# Altium project FD-JUL-CB1.PrjPcb
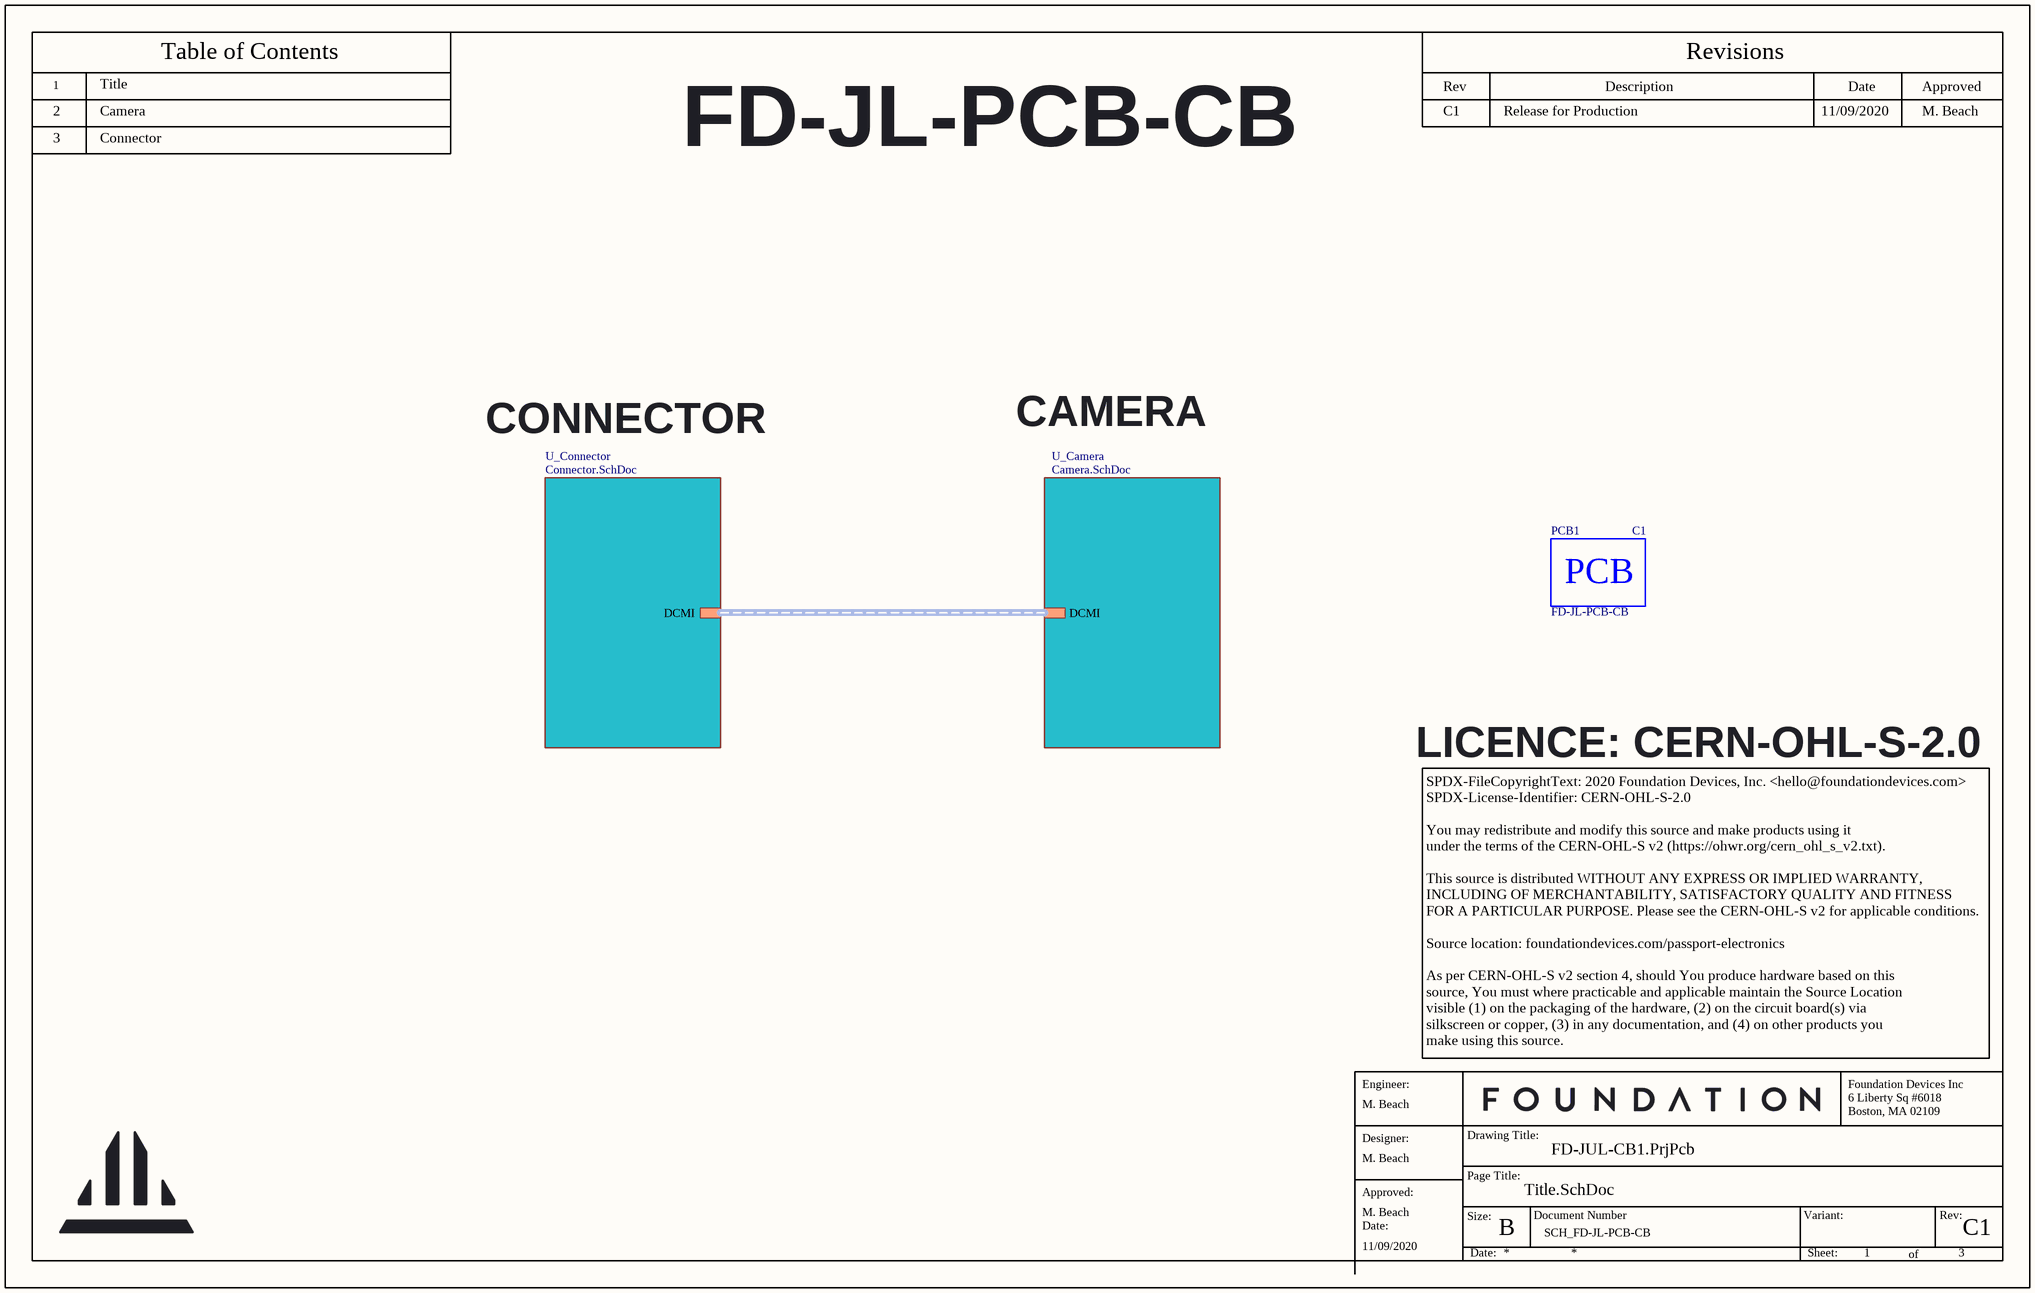
[diagram p0: Title.SchDoc]
SCH_REV: C1; PCB_REV: C1; PCB_PART_NUMBER: FD-JL-PCB-CB; PCB_ENGINEER_APP_DATE: 11/09/2020; PCB_ENGINEER: M. Beach; PCB_DWG_NO: PCB-DWG_FD-JL-PCB-CB; PCB_DESIGNER_APP_DATE: 11/09/2020; PCB_DESIGNER: M. Beach; PCB_CHECKER_APP_DATE: 11/09/2020; PCB_CHECKER: M. Beach; PCB_ASSEMBLY_NO: PCB-ASSY_FD-JL-PCB-CB; PCB_ANG_TOL: +/-1/2; PCB_3_DEC_TOL: +/-.010; PCB_2_DEC_TOL: +/-.01; NotFitted: NF; DOC_NO_SCH_DWG: SCH_FD-JL-PCB-CB; DOC_NO_FAB_DWG: FAB_FD-JL-PCB-CB; DOC_NO_BOM: BOM_FD-JL-PCB-CB; DOC_NO_ASSY_DWG: ASSY_FD-JL-PCB-CB
3 sheets, 21 parts. Net scope: hierarchical (ports join the sheet entries above them; power ports are global).
Board file: FD-JUL-CB1_PCB.PcbDoc
Sheets:
  Title.SchDoc
    U_Connector = Connector.SchDoc
    U_Camera = Camera.SchDoc

## Sheet Title.SchDoc
size B; DocumentNumber: 1; SheetNumber: 1; SheetTotal: 3; ENG_APP_DATE: --/--/--; DSN_APP_DATE: --/--/--; CHK_APP_DATE: --/--/--

### Parts
PCB1  FD-JL-PCB-CB  Rev: C1  (mechanical)

### Sub-sheets
U_Camera = Camera.SchDoc: DCMI (harness DCMI)
U_Connector = Connector.SchDoc: DCMI (harness DCMI)

### Buses and harness runs
harness sheet U_Camera/DCMI = sheet U_Connector/DCMI

### Notes on the sheet
- Title
- 2
- 3
- Camera
- Connector
- FD-JL-PCB-CB
- C1
- Release for Production
- 11/09/2020
- M. Beach
- CAMERA
- CONNECTOR
- LICENCE: CERN-OHL-S-2.0
- SPDX-FileCopyrightText: 2020 Foundation Devices, Inc. <hello@foundationdevices.com>
  SPDX-License-Identifier: CERN-OHL-S-2.0
  You may redistribute and modify this source and make products using it
  under the terms of the CERN-OHL-S v2 (https://ohwr.org/cern_ohl_s_v2.txt).
  This source is distributed WITHOUT ANY EXPRESS OR IMPLIED WARRANTY,
  INCLUDING OF MERCHANTABILITY, SATISFACTORY QUALITY AND FITNESS
  FOR A PARTICULAR PURPOSE. Please see the CERN-OHL-S v2 for applicable conditions.
  Source location: foundationdevices.com/passport-electronics
  As per CERN-OHL-S v2 section 4, should You produce hardware based on this
  source, You must where practicable and applicable maintain the Source Location
  visible (1) on the packaging of the hardware, (2) on the circuit board(s) via
  silkscreen or copper, (3) in any documentation, and (4) on other products you
  make using this source.
- 1
- Table of Contents
- Rev
- Description
- Revisions
- Date
- Approved
- Engineer:
- Foundation Devices Inc
- 6 Liberty Sq #6018
- Designer:
- Drawing Title:
- Page Title:
- Boston, MA 02109
- Approved:
- Date:
- Size:
- B
- Document Number
- Variant:
- Rev:
- Sheet:
- of

### Library data of the parts
PCB1 = CMP-MISC-00003-3: PCB - Juliet - Camera Board

## Sheet Connector.SchDoc
size B; DocumentNumber: 3; SheetNumber: 3; SheetTotal: 3; ENG_APP_DATE: --/--/--; DSN_APP_DATE: --/--/--; CHK_APP_DATE: --/--/--
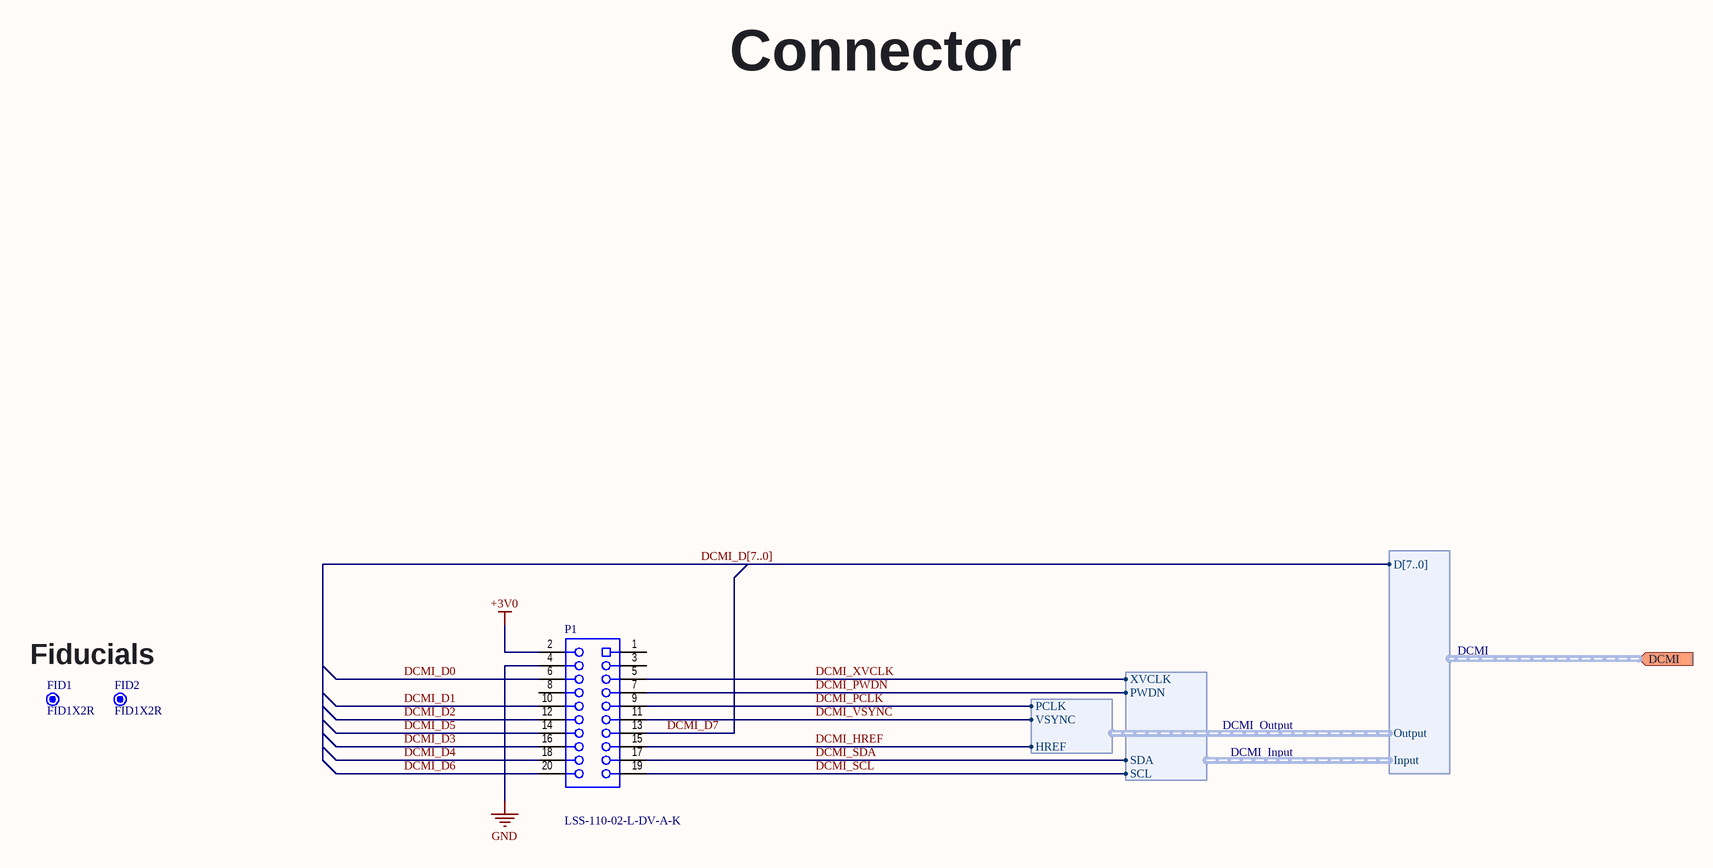
[diagram p1: Connector.SchDoc]

### Parts
FID1  FID1X2R  [FID1X2R]  (no BOM)
FID2  FID1X2R  [FID1X2R]  (no BOM)
P1  LSS-110-02-L-DV-A-K  [SMTC - LSS-110-02-L-DV-A_V]

### Ports
DCMI (in, harness DCMI)

### Harnesses
DCMI: Input, Output, D[7..0]
DCMI_Input: PWDN, SCL, SDA, XVCLK
DCMI_Output: HREF, PCLK, VSYNC

### Nets
+3V0: P1.2
GND: P1.4
DCMI_D0: P1.6
DCMI_D1: P1.10
DCMI_D2: P1.12
DCMI_D3: P1.16
DCMI_D4: P1.18
DCMI_D5: P1.14
DCMI_D6: P1.20
DCMI_D7: P1.13
DCMI_HREF: P1.15 ; harness DCMI_Output.HREF
DCMI_PCLK: P1.9 ; harness DCMI_Output.PCLK
DCMI_PWDN: P1.7 ; harness DCMI_Input.PWDN
DCMI_SCL: P1.19 ; harness DCMI_Input.SCL
DCMI_SDA: P1.17 ; harness DCMI_Input.SDA
DCMI_VSYNC: P1.11 ; harness DCMI_Output.VSYNC
DCMI_XVCLK: P1.5 ; harness DCMI_Input.XVCLK

Not connected (* = marked no-connect by the designer): P1 1 3 8

### Buses and harness runs
bus DCMI_D[7..0]

### Notes on the sheet
- Connector
- Fiducials
- Drawing Title:
- Page Title:
- Size:
- B
- Document Number
- Variant:
- Rev:
- Date:
- Sheet:
- of

### Library data of the parts
FID1 FID2 = CMP-MECH-00000-3: Fiducial - Round 1x2mm; Pins: 0
P1 = CMP-CON-0021-3: 20 Position Connector Self Mating, Non-Gendered Surface Mount Gold; Number of Contacts: 20; Pitch: 0.635mm; Termination: Solder; Radiation Hardening: No; Number of Rows: 2; Packaging: Bulk; Contact Plating: Gold

## Sheet Camera.SchDoc
size B; DocumentNumber: 2; SheetNumber: 2; SheetTotal: 3; ENG_APP_DATE: --/--/--; DSN_APP_DATE: --/--/--; CHK_APP_DATE: --/--/--
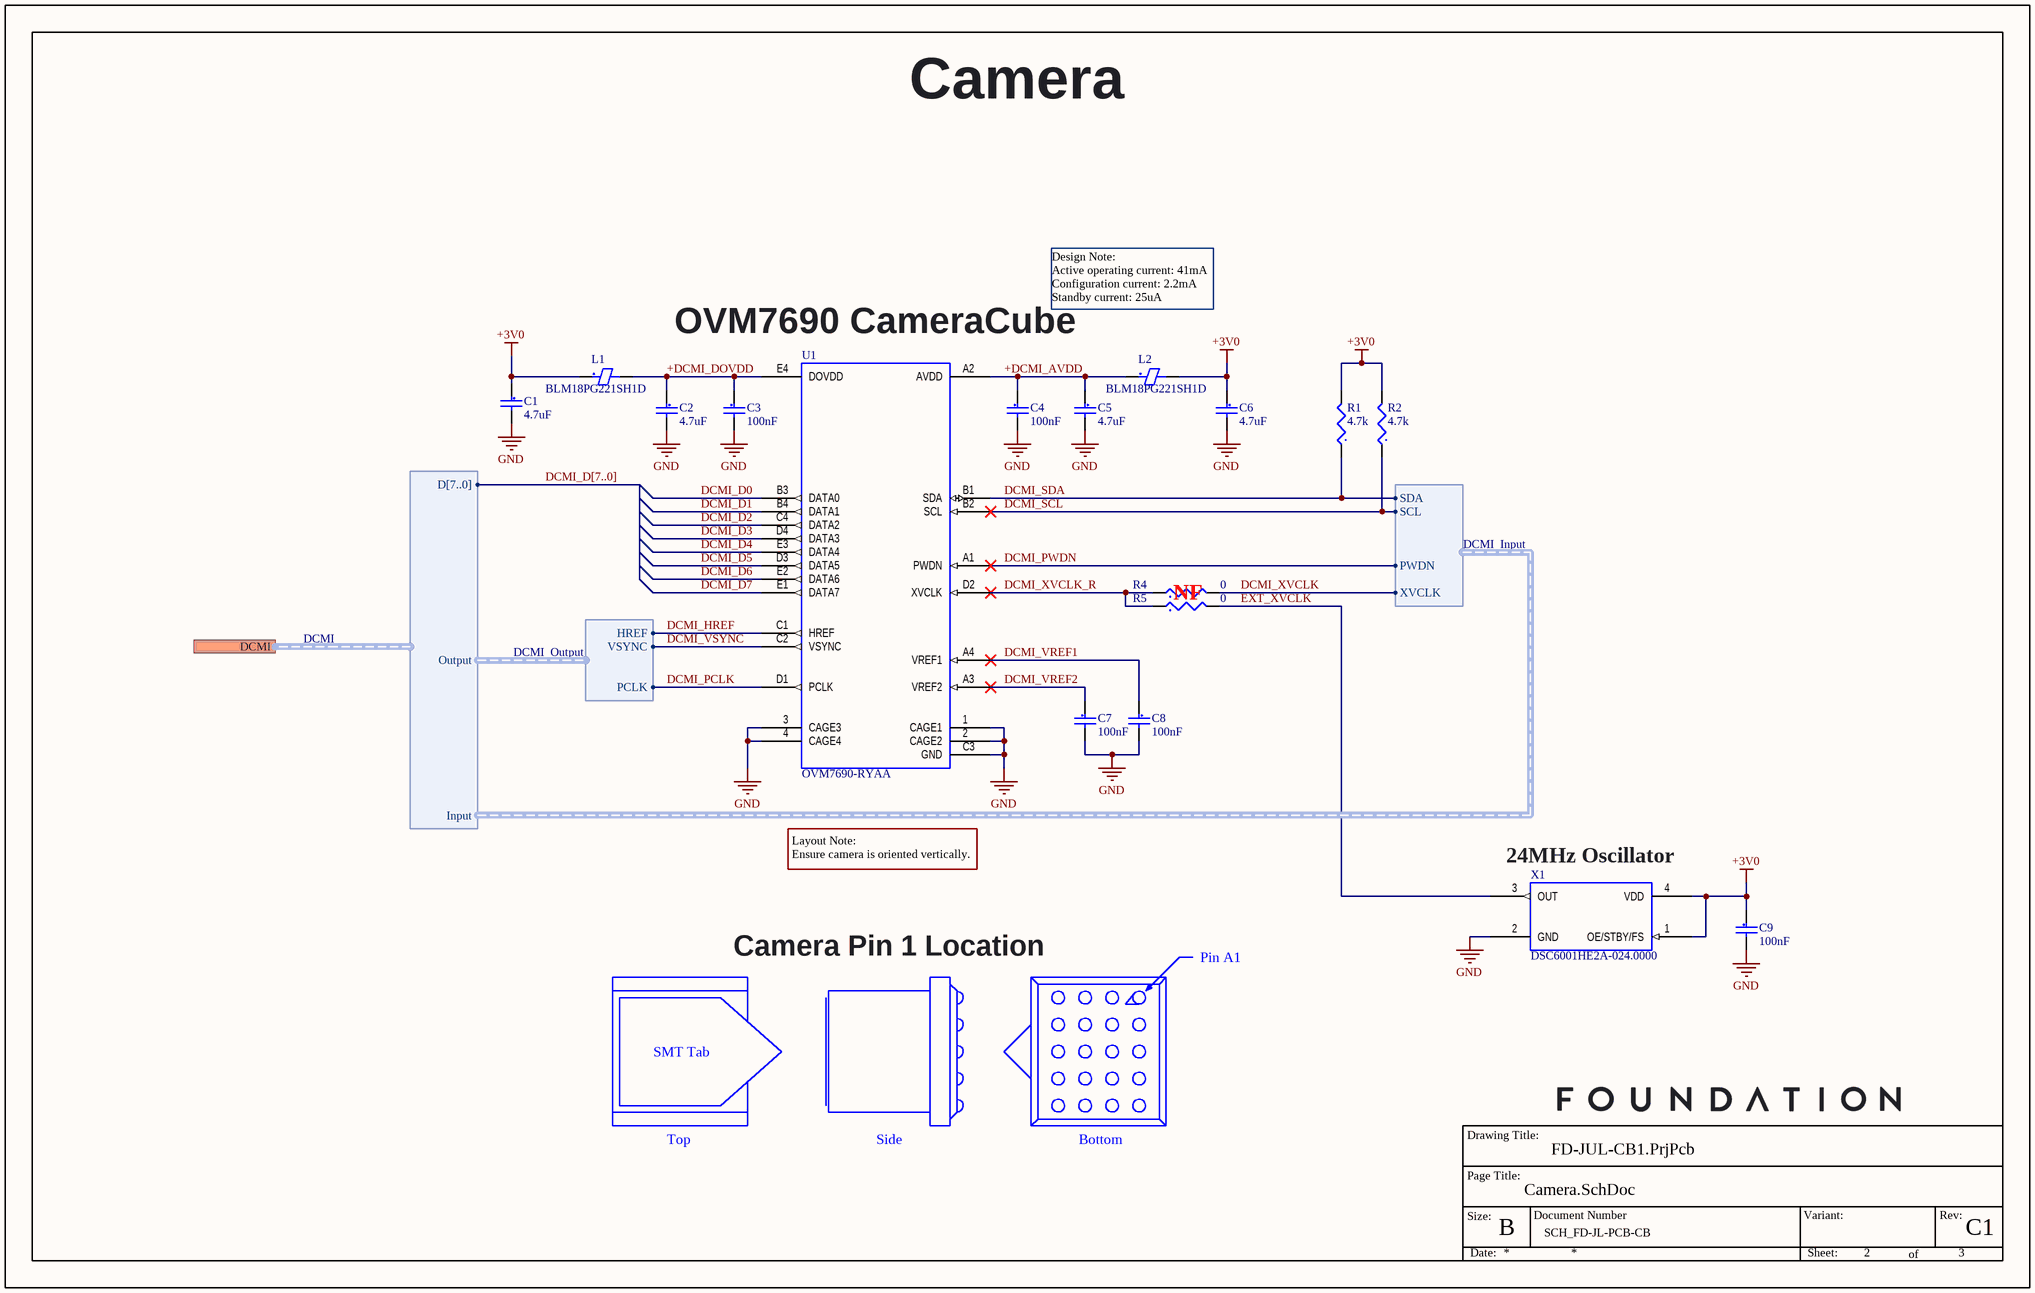
[diagram p2: Camera.SchDoc]

### Parts
C1  Capacitance: 4.7uF  [CAPC0603(1608)90_L]  (hidden comment: CAP CER 4.7uF 16V 10% X5R 0603)
C2  Capacitance: 4.7uF  [CAPC0603(1608)90_L]  (hidden comment: CAP CER 4.7uF 16V 10% X5R 0603)
C3  Capacitance: 100nF  [CAPC0402(1005)55_L]  (hidden comment: CAP CER 0.1uF 16V 10% X7R 0402)
C4  Capacitance: 100nF  [CAPC0402(1005)55_L]  (hidden comment: CAP CER 0.1uF 16V 10% X7R 0402)
C5  Capacitance: 4.7uF  [CAPC0603(1608)90_L]  (hidden comment: CAP CER 4.7uF 16V 10% X5R 0603)
C6  Capacitance: 4.7uF  [CAPC0603(1608)90_L]  (hidden comment: CAP CER 4.7uF 16V 10% X5R 0603)
C7  Capacitance: 100nF  [CAPC0402(1005)55_L]  (hidden comment: CAP CER 0.1uF 16V 10% X7R 0402)
C8  Capacitance: 100nF  [CAPC0402(1005)55_L]  (hidden comment: CAP CER 0.1uF 16V 10% X7R 0402)
C9  Capacitance: 100nF  [CAPC0402(1005)55_L]  (hidden comment: CAP CER 0.1uF 16V 10% X7R 0402)
L1  BLM18PG221SH1D  [FBC0603(1608)90_L]
L2  BLM18PG221SH1D  [FBC0603(1608)90_L]
R1  Resistance: 4.7k  [RESC0402(1005)_L]  (hidden comment: RES 4.7K 1/16W 1% 0402)
R2  Resistance: 4.7k  [RESC0402(1005)_L]  (hidden comment: RES 4.7K 1/16W 1% 0402)
R4  Resistance: 0  [RESC0402(1005)_L]  (hidden comment: RES 0 OHM JUMPER 1/16W 0402)
R5  Resistance: 0  [RESC0402(1005)_L]  (hidden comment: RES 0 OHM JUMPER 1/16W 0402)
U1  OVM7690-RYAA  [OMNI - CCBGA-CG-20]
X1  DSC6001HE2A-024.0000  [MCHP - VFLGA-1612-4_L]

### Ports
DCMI (harness DCMI)

### Harnesses
DCMI_Input: SDA, SCL, PWDN, XVCLK
DCMI_Output: HREF, VSYNC, PCLK
DCMI: Input, Output, D[7..0]

### Nets
+3V0: C1.1 C6.1 C9.1 L1.1 L2.2 R1.2 R2.2 X1.1(OE/STBY/FS) X1.4(VDD)
GND: C1.2 C2.2 C3.2 C4.2 C5.2 C6.2 C7.2 C8.2 C9.2 U1.1(CAGE1) U1.2(CAGE2) U1.3(CAGE3) U1.4(CAGE4) U1.C3(GND) X1.2(GND)
+DCMI_AVDD: C4.1 C5.1 L2.1 U1.A2(AVDD)
+DCMI_DOVDD: C2.1 C3.1 L1.2 U1.E4(DOVDD)
DCMI_D0: U1.B3(DATA0)
DCMI_D1: U1.B4(DATA1)
DCMI_D2: U1.C4(DATA2)
DCMI_D3: U1.D4(DATA3)
DCMI_D4: U1.E3(DATA4)
DCMI_D5: U1.D3(DATA5)
DCMI_D6: U1.E2(DATA6)
DCMI_D7: U1.E1(DATA7)
DCMI_HREF: U1.C1(HREF) ; harness DCMI_Output.HREF
DCMI_PCLK: U1.D1(PCLK) ; harness DCMI_Output.PCLK
DCMI_PWDN: U1.A1(PWDN) ; harness DCMI_Input.PWDN
DCMI_SCL: R2.1 U1.B2(SCL) ; harness DCMI_Input.SCL
DCMI_SDA: R1.1 U1.B1(SDA) ; harness DCMI_Input.SDA
DCMI_VREF1: C8.1 U1.A4(VREF1)
DCMI_VREF2: C7.1 U1.A3(VREF2)
DCMI_VSYNC: U1.C2(VSYNC) ; harness DCMI_Output.VSYNC
DCMI_XVCLK: R4.2 ; harness DCMI_Input.XVCLK
DCMI_XVCLK_R: R4.1 R5.1 U1.D2(XVCLK)
EXT_XVCLK: R5.2 X1.3(OUT)

### Buses and harness runs
bus DCMI_D[7..0]

### Notes on the sheet
- Camera
- (near U1) OVM7690 CameraCube
- Design Note:
  Active operating current: 41mA
  Configuration current: 2.2mA
  Standby current: 25uA
- Layout Note:
  Ensure camera is oriented vertically.
- (near X1) 24MHz Oscillator
- Camera Pin 1 Location
- Pin A1
- SMT Tab
- Top
- Side
- Bottom
- Drawing Title:
- Page Title:
- Size:
- B
- Document Number
- Variant:
- Rev:
- Date:
- Sheet:
- of

### Library data of the parts
C1 C2 C5 C6 = CMP-CAP-00003-1: 4.7µF ±10% 16V Ceramic Capacitor X5R 0603 (1608 Metric); Length: 1.6mm; Termination: SMD/SMT; Max Operating Temperature: 85°C; Case Code (Imperial): 0603; Height: 0.8mm; Voltage Rating: 16V; Composition: Ceramic; Dielectric: X5R; Voltage Rating (DC): 16V; REACH SVHC: No SVHC; Case Code (Metric): 1608; Tolerance: 10%; Case/Package: 0603; Min Operating Temperature: -55°C; Width: 0.8mm; Mount: Surface Mount; Packaging: Tape and Reel; Package Quantity: 1; Thickness: 0.035inch; Number of Pins: 2
C3 C4 C7-C9 = CMP-CAP-00002-2: 0.1µF ±10% 16V Ceramic Capacitor X7R 0402 (1005 Metric); Insulation Resistance: 10GR; Material: Ceramic; Tolerance: 10%; REACH SVHC: No SVHC; Radiation Hardening: No; Case Code (Metric): 1005; Height: 0.5mm; Depth: 0.5mm; Min Operating Temperature: -55°C; Max Operating Temperature: 125°C; Lead Free: Lead Free; Thickness: 0.022inch; Length: 1mm; Voltage Rating (DC): 16V; Dielectric Material: Ceramic; Packaging: Tape and Reel; Case/Package: 0402; Width: 0.5mm; Termination: SMD/SMT; Voltage Rating: 16V; Mount: Surface Mount; Case Code (Imperial): 0402; Package Quantity: 1; Dielectric: X7R; Number of Pins: 2; Voltage: 16V
L1 L2 = CMP-FLT-0001-1: FERRITE BEAD 220 OHM 0603 1LN; Impedance: 220R; Number of Circuits: 1; Tolerance: 25%; Max DC Current: 1.4A; Test Frequency: 100MHz; DC Resistance (DCR): 100mR; Packaging: Tape and Reel; Length: 0.063inch; Case Code (Metric): 1608; Termination: SMD/SMT; Height: 0.037inch; Ratings: AEC-Q200; Max Operating Temperature: 125°C; Depth: 0.95mm; Lead Free: Lead Free; Current Rating: 1.4A; Mount: Surface Mount; ComponentLink1Description: Datasheet; Case/Package: 0603; Number of Lines: 1; Max Current Rating: 1.4A; Case Code (Imperial): 0603; Min Operating Temperature: -55°C; Width: 0.8mm; REACH SVHC: No SVHC; Core Material: Ferrite; ComponentLink1URL: https://www.murata.com/en-us/products/productdata/8796737273886/QNFA9101.pdf; Package Quantity: 4000
R1 R2 = CMP-RES-00002-3: 4.7 kOhms ±1% 0.063W, 1/16W Chip Resistor 0402 (1005 Metric) Automotive AEC-Q200 Thick Film; Max Power Dissipation: 63mW; Voltage Rating (DC): 50V; Temperature Coefficient: 100ppm/°C; Weight: 2.3E-05oz; Package Quantity: 10; Military Standard: Not; Contact Plating: Tin; Termination: SMD/SMT; Max Operating Temperature: 155°C; Case Code (Metric): 1005; Case Code (Imperial): 0402; Features: Automotive AEC-Q200; Power Rating: 63mW; REACH SVHC: Unknown; Min Operating Temperature: -55°C; Tolerance: 1%; Mount: Surface Mount; Width: 0.5mm; Depth: 0.5mm; Radiation Hardening: No; Length: 1mm; Number of Terminations: 2; Case/Package: 0402; Voltage Rating: 50V; Height: 0.35mm; Packaging: Tape and Reel; Lead Free: Lead Free; Composition: Thick Film
R4 R5 = CMP-RES-00014-4: 0 Ohms Jumper 0.063W, 1/16W Chip Resistor 0402 (1005 Metric); Max Power Dissipation: 63mW; Tolerance: 5%; Power Rating: 62.5mW; Voltage Rating: 50V; Temperature Coefficient: 200ppm/°C; Case/Package: 0402; Height: 0.016inch; Termination: SMD/SMT; Military Standard: Not; Number of Terminations: 2; Length: 1mm; Features: Moisture Resistant; Max Operating Temperature: 155°C; Case Code (Metric): 1005; Width: 0.02inch; Package Quantity: 1; Case Code (Imperial): 0402; Contact Plating: Tin,Matte; Packaging: Tape and Reel; REACH SVHC: Unknown; Radiation Hardening: No; Lead Free: Lead Free; Min Operating Temperature: -55°C; Composition: Thick Film; Depth: 0.5mm
U1 = CMP-SEN-0001-10: SENSOR CAMERA CMOS 20CAMERACUBE; Min Operating Temperature: -30°C; Number of Pins: 20; Packaging: Tape and Reel; Max Operating Temperature: 70°C; Package Quantity: 2500
X1 = CMP-XTAL-0002-1: XO (Standard) CMOS Oscillator 1.8V ~ 3.3V Enable/Disable 4-SMD, No Lead; Frequency Stability: 25ppm; Max Supply Current: 1.3mA; Frequency: 24MHz; ComponentLink1URL: https://ww1.microchip.com/downloads/en/DeviceDoc/DSC60XX-Ultra-Small-Ultra-Low-Power-MEMS-Oscillator-DS20005625C.pdf; Case/Package: SMD/SMT; ComponentLink1Description: Datasheet; Min Operating Temperature: -20°C; Max Operating Temperature: 70°C; Ratings: AEC-Q100; Packaging: Bag; Mount: Surface Mount

## Nets that join several sheets
+3V0: Connector (P1.2), Camera (9 pins)
GND: Connector (P1.4), Camera (15 pins)
DCMI_D0: Connector (P1.6), Camera (U1.B3)
DCMI_D1: Connector (P1.10), Camera (U1.B4)
DCMI_D2: Connector (P1.12), Camera (U1.C4)
DCMI_D3: Connector (P1.16), Camera (U1.D4)
DCMI_D4: Connector (P1.18), Camera (U1.E3)
DCMI_D5: Connector (P1.14), Camera (U1.D3)
DCMI_D6: Connector (P1.20), Camera (U1.E2)
DCMI_D7: Connector (P1.13), Camera (U1.E1)
DCMI_HREF: Connector (P1.15), Camera (U1.C1)
DCMI_PCLK: Connector (P1.9), Camera (U1.D1)
DCMI_PWDN: Connector (P1.7), Camera (U1.A1)
DCMI_SCL: Connector (P1.19), Camera (R2.1 U1.B2)
DCMI_SDA: Connector (P1.17), Camera (R1.1 U1.B1)
DCMI_VSYNC: Connector (P1.11), Camera (U1.C2)
DCMI_XVCLK: Connector (P1.5), Camera (R4.2)

## Assembly variants
Production: not fitted R4